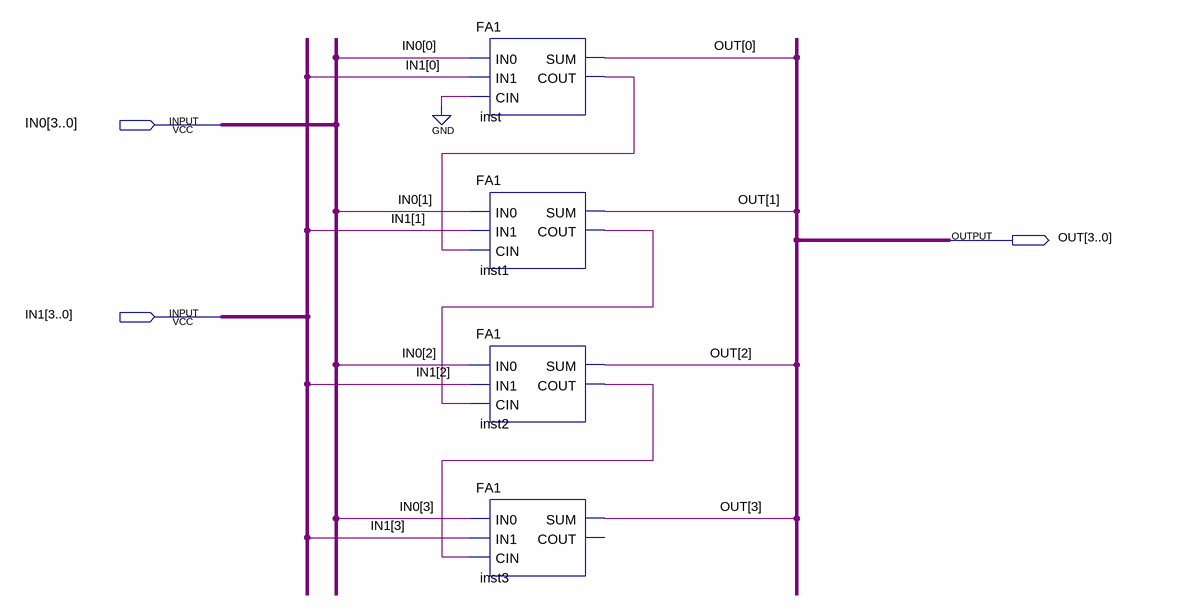
[diagram p0: schematic sheet]
// Quartus schematic FA4.bdf as structural Verilog: 4 symbols, 3 pins
module FA4 (
  input  [3:0] IN0,
  input  [3:0] IN1,
  output [3:0] OUT
);

  wire inst1_cout, inst2_cout, inst_cout;

  FA1 inst (.IN0(IN0[0]), .IN1(IN1[0]), .CIN(1'b0), .SUM(OUT[0]), .COUT(inst_cout));
  FA1 inst1 (.IN0(IN0[1]), .IN1(IN1[1]), .CIN(inst_cout), .SUM(OUT[1]), .COUT(inst1_cout));
  FA1 inst2 (.IN0(IN0[2]), .IN1(IN1[2]), .CIN(inst1_cout), .SUM(OUT[2]), .COUT(inst2_cout));
  FA1 inst3 (.IN0(IN0[3]), .IN1(IN1[3]), .CIN(inst2_cout), .SUM(OUT[3]));  // open: COUT
endmodule
